# Altium project Sampler.PrjPCB (part 3 of 3)

## Sheet Input_channel.SchDoc: Input chnannel
size 420 x 297 mm; Author: G.K.; CompanyName: WUT; DrawnBy: G.K.; Organization: CERN; Address1: Warsaw Univeristy of Technology; Address2: Nowowiejska 15/19; DocumentNumber: 3; Revision: -; SheetNumber: 3; SheetTotal: 5; EDA_Number: ARTIQ; Projet: Sampler; ModifiedBy: -; CreateDate: XX/XX/XXXX; CheckedDate: -; Title2: DPGA; DivGrp: ISE; Designer: G.K.; ModifiedDate: -; ProjectName: Sampler
Used 8 times, as channels U_Input_channel, U_Input_channel, U_Input_channel, U_Input_channel, U_Input_channel, U_Input_channel, U_Input_channel, U_Input_channel. Parts and nets are listed once, with the designators drawn on the sheet.
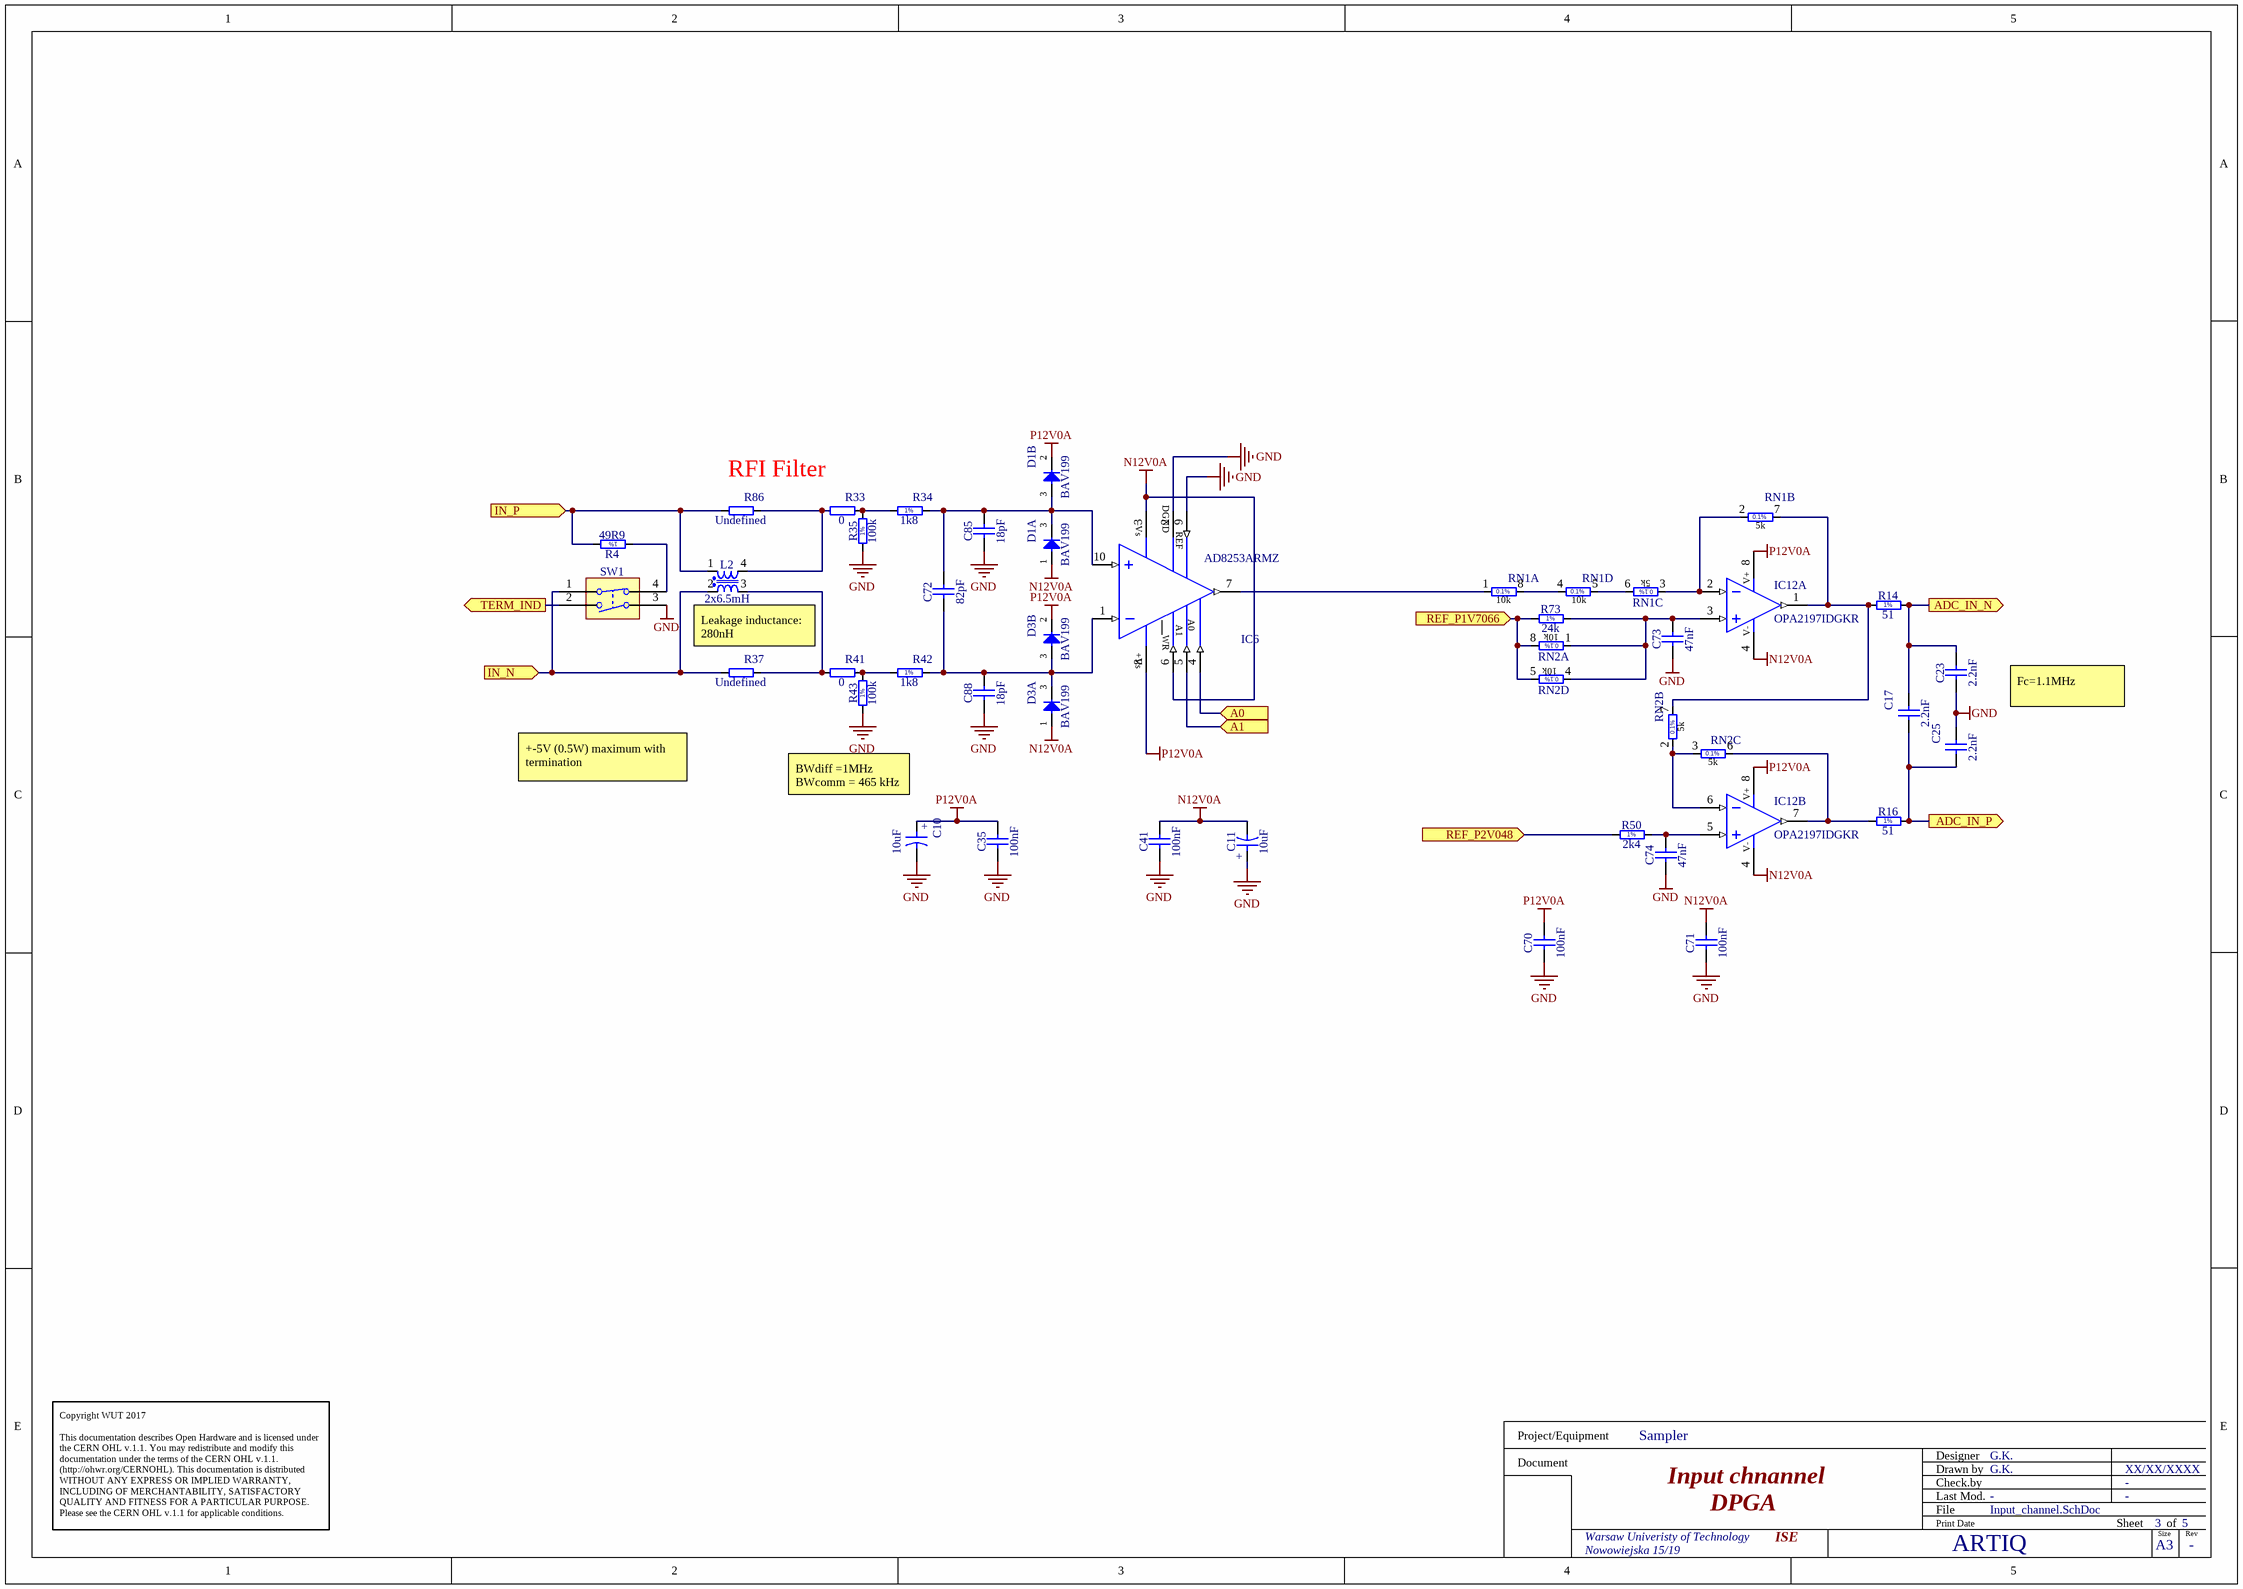
[diagram p5: Input_channel.SchDoc]

### Parts
C10  10uF  [CAPMP3216X180N]
C11  10uF  [CAPMP3216X180N]
C17  2.2nF  [CAPC2013X100N]
C23  2.2nF  [CAPC2013X100N]
C25  2.2nF  [CAPC2013X100N]
C35  100nF  [CAPC1005X55N]
C41  100nF  [CAPC1005X55N]
C70  100nF  [CAPC1005X55N]
C71  100nF  [CAPC1005X55N]
C72  82pF  [CAPC2012X90N]
C73  47nF  [CAPC2012X135N]
C74  47nF  [CAPC2012X135N]
C85  18pF  [CAPC1608X87N]
C88  18pF  [CAPC1608X87N]
D1  BAV199  [SOT95P240X110-3N]  (parts A,B of 2)
D3  BAV199  [SOT95P240X110-3N]  (parts A,B of 2)
IC6  AD8253ARMZ  [SOP50P490X110-10N]
IC12  OPA2197IDGKR  [SOP65P490X110-8N]  (parts A,B of 2)
L2  2x6.5mH  [IND_WURTH_WE-SL2]
R4  49R9  [RESC6331X70N]
R14  51  [RESC1005X40N]
R16  51  [RESC1005X40N]
R33  0  [RESC1608X55N]
R34  1k8  [RESC1608X55N]
R35  100k  [RESC1608X55N]
R37  Undefined  [RESC1608X55N]
R41  0  [RESC1608X55N]
R42  1k8  [RESC1608X55N]
R43  100k  [RESC1608X55N]
R50  2k4  [RESC1005X40N]
R73  24k  [RESC1608X55N]
R86  Undefined  [RESC1608X55N]
RN1  10k 5K 5K 10K  [SOIC127P600X175-8N]  (value not drawn)  (parts A,B,C,D of 4)
RN2  10k 5K 5K 10K  [SOIC127P600X175-8N]  (value not drawn)  (parts A,B,C,D of 4)
SW1  Switch  [SW_CTS_204-121ST]  (value not drawn)

### Ports
A0 (in), A1 (in), ADC_IN_N (out), ADC_IN_P (out), IN_N (in), IN_P (in), REF_P1V7066 (in), REF_P2V048 (in), TERM_IND (out)

### Nets
GND: C10.2 C11.1 C23.1 C25.2 C35.1 C41.1 C70.1 C71.1 C73.1 C74.1 C85.1 C88.1 IC6.2(DGND) IC6.9(REF) R35.1 R43.1 SW1.3
N12V0A: C11.2 C41.2 C71.2 D1.1(A) D3.1(A) IC6.3(-VS) IC6.6(~{WR}) IC12.4(V-)
P12V0A: C10.1 C35.2 C70.2 D1.2(C) D3.2(C) IC6.8(+VS) IC12.8(V+)
A0: IC6.4(A0) ; port A0
A1: IC6.5(A1) ; port A1
ADC_IN_N: C17.2 C23.2 R14.2 ; port ADC_IN_N
ADC_IN_P: C17.1 C25.1 R16.2 ; port ADC_IN_P
IN_N: L2.2 R37.1 SW1.1 ; port IN_N
IN_P: L2.1 R4.2 R86.1 ; port IN_P
REF_P1V7066: R73.1 RN2.5 RN2.8 ; port REF_P1V7066
REF_P2V048: R50.1 ; port REF_P2V048
TERM_IND: SW1.2 ; port TERM_IND
NetC72_1: C72.1 C88.2 D3.3(COMAC) IC6.1(-IN) R42.2
NetC72_2: C72.2 C85.2 D1.3(COMAC) IC6.10(+IN) R34.2
NetC73_2: C73.2 IC12.3(IN+) R73.2 RN2.1 RN2.4
NetC74_2: C74.2 IC12.5(IN+) R50.2
NetIC6_7: IC6.7(OUT) RN1.1
NetIC12_1: IC12.1(OUT) R14.1 RN1.7 RN2.7
NetIC12_2: IC12.2(IN-) RN1.2 RN1.3
NetIC12_6: IC12.6(IN-) RN2.2 RN2.3
NetIC12_7: IC12.7(OUT) R16.1 RN2.6
NetL2_3: L2.3 R37.2 R41.1
NetL2_4: L2.4 R33.1 R86.2
NetR4_1: R4.1 SW1.4
NetR33_2: R33.2 R34.1 R35.2
NetR41_2: R41.2 R42.1 R43.2
NetRN1_4: RN1.4 RN1.8
NetRN1_5: RN1.5 RN1.6

### Channels
U_Input_channel: designators end in A; ports A0=CH7_A0 A1=CH7_A1 ADC_IN_N=IN_7_N ADC_IN_P=IN_7_P IN_N=ADC_IN_N7 IN_P=ADC_IN_P7 REF_P1V7066=REF_P1V7066 REF_P2V048=REF_P2V048 TERM_IND=TERM_STAT7
U_Input_channel: designators end in B; ports A0=CH6_A0 A1=CH6_A1 ADC_IN_N=IN_6_N ADC_IN_P=IN_6_P IN_N=ADC_IN_N6 IN_P=ADC_IN_P6 REF_P1V7066=REF_P1V7066 REF_P2V048=REF_P2V048 TERM_IND=TERM_STAT6
U_Input_channel: designators end in C; ports A0=CH5_A0 A1=CH5_A1 ADC_IN_N=IN_5_N ADC_IN_P=IN_5_P IN_N=ADC_IN_N5 IN_P=ADC_IN_P5 REF_P1V7066=REF_P1V7066 REF_P2V048=REF_P2V048 TERM_IND=TERM_STAT5
U_Input_channel: designators end in D; ports A0=CH4_A0 A1=CH4_A1 ADC_IN_N=IN_4_N ADC_IN_P=IN_4_P IN_N=ADC_IN_N4 IN_P=ADC_IN_P4 REF_P1V7066=REF_P1V7066 REF_P2V048=REF_P2V048 TERM_IND=TERM_STAT4
U_Input_channel: designators end in E; ports A0=CH3_A0 A1=CH3_A1 ADC_IN_N=IN_3_N ADC_IN_P=IN_3_P IN_N=ADC_IN_N3 IN_P=ADC_IN_P3 REF_P1V7066=REF_P1V7066 REF_P2V048=REF_P2V048 TERM_IND=TERM_STAT3
U_Input_channel: designators end in F; ports A0=CH2_A0 A1=CH2_A1 ADC_IN_N=IN_2_N ADC_IN_P=IN_2_P IN_N=ADC_IN_N2 IN_P=ADC_IN_P2 REF_P1V7066=REF_P1V7066 REF_P2V048=REF_P2V048 TERM_IND=TERM_STAT2
U_Input_channel: designators end in G; ports A0=CH1_A0 A1=CH1_A1 ADC_IN_N=IN_1_N ADC_IN_P=IN_1_P IN_N=ADC_IN_N1 IN_P=ADC_IN_P1 REF_P1V7066=REF_P1V7066 REF_P2V048=REF_P2V048 TERM_IND=TERM_STAT1
U_Input_channel: designators end in H; ports A0=CH0_A0 A1=CH0_A1 ADC_IN_N=IN_0_N ADC_IN_P=IN_0_P IN_N=ADC_IN_N0 IN_P=ADC_IN_P0 REF_P1V7066=REF_P1V7066 REF_P2V048=REF_P2V048 TERM_IND=TERM_STAT0

### Notes on the sheet
- RFI Filter
- (near L2) Leakage inductance: 280nH
- Fc=1.1MHz
- +-5V (0.5W) maximum with termination
- BWdiff =1MHz
  BWcomm = 465 kHz
- Copyright WUT 2017
  This documentation describes Open Hardware and is licensed under the CERN OHL v.1.1. You may redistribute and modify this documentation under the terms of the CERN OHL v.1.1. (http://ohwr.org/CERNOHL). This documentation is distributed WITHOUT ANY EXPRESS OR IMPLIED WARRANTY, INCLUDING OF MERCHANTABILITY, SATISFACTORY QUALITY AND FITNESS FOR A PARTICULAR PURPOSE. Please see the CERN OHL v.1.1 for applicable conditions.
- Project/Equipment
- Document
- Designer
- Drawn by
- Check.by
- File
- Last Mod.
- Print Date
- Sheet
- Size
- A3
- of
- Rev
- (in symbol AD8253ARMZ) -Vs; WR; +Vs
- (in symbol CTE3216-18_10UF_16V_20%_AVX_TCJ) +
- (in symbol R0402_2K4_1%_0.0625W_100PPM) 1%
- (in symbol R0402_51R_1%_0.0625W_100PPM) 1%
- (in symbol R0603_1K8_1%_0.1W_100PPM) 1%
- (in symbol R0603_24K_1%_0.1W_100PPM) 1%
- (in symbol R0603_100K_1%_0.1W_100PPM) 1%
- (in symbol R2512_49R9_1%_1W_100PPM_VISHAY_CRCW) 1%
- (in symbol RN_10K_5K_VISHAY_AORN2-1AT3, part A) 10k
- (in symbol RN_10K_5K_VISHAY_AORN2-1AT3, part B) 5k
- (in symbol RN_10K_5K_VISHAY_AORN2-1AT3, part C) 5k
- (in symbol RN_10K_5K_VISHAY_AORN2-1AT3, part D) 10k

### Library data of the parts
C10 C11 = CTE3216-18_10UF_16V_20%_AVX_TCJ: Polarised capacitor; Part Description: ESR 0R200 Tantalum Solid Electrolytic Chip Capacitor with Conductive Polymer Electrode; Manufacturer: AVX; Manufacturer Part Number: TCJA106M016R0200; Voltage: 16V; Tolerance: ±20%; Part Number: CTE3216-18_10UF_16V_20%_AVX_TCJ; Component Kind: Standard; Component Type: Standard; Pin Count: 2; Value: 10uF; Status: Preferred; Case: A; Mounted: Yes; Socket: No; SMD: Yes; Sense: No; ComponentHeight: 1.8mm; HelpURL: \\cern.ch\dfs\Applications\Altium\Datasheets\CTE_AVX_TCJ.pdf; Author: CERN DEM JLC; CreateDate: 29.03.2012; LatestRevisionDate: 29.03.2012
C17 C23 C25 = CC0805_2.2NF_25V_1%_C0G: Non-polarised capacitor; Part Description: SMD Multilayer Chip Ceramic Capacitor; Manufacturer: GENERIC; Manufacturer1 Part Number: C0805C222F3GACTU; Voltage: 25V; TC: C0G/NP0; Tolerance: ±1%; Part Number: CC0805_2.2NF_25V_1%_C0G; Component Kind: Standard; Component Type: Standard; Pin Count: 2; Value: 2.2nF; Status: None; Manufacturer Part Number: CC0805_2.2NF_25V_1%_C0G; Case: 0805; Mounted: Yes; Socket: No; SMD: Yes; Sense: No; Manufacturer1 Example: KEMET; Manufacturer1 ComponentHeight: 0.88mm; HelpURL: \\cern.ch\dfs\Applications\Altium\Datasheets\CC0805_C0G_KEMET_(Commercial Grade).pdf; Author: CERN DEM JLC; CreateDate: 11.03.2015; LatestRevisionDate: 11.03.2015
C35 C41 C70 C71 = CC0402_100NF_16V_10%_X7R: Non-polarised capacitor; Part Description: SMD Multilayer Chip Ceramic Capacitor; Manufacturer: GENERIC; Manufacturer1 Part Number: GRM155R71C104KA88D; Voltage: 16V; TC: X7R; Tolerance: ±10%; Part Number: CC0402_100NF_16V_10%_X7R; Component Kind: Standard; Component Type: Standard; Pin Count: 2; Value: 100nF; Status: Not Recommended; Manufacturer Part Number: CC0402_100NF_16V_10%_X7R; Case: 0402; Mounted: Yes; Socket: No; SMD: Yes; Sense: No; Manufacturer1 Example: MURATA; Manufacturer1 ComponentHeight: 0.55mm; HelpURL: \\cern.ch\dfs\Applications\Altium\Datasheets\CC0402_X7R_MURATA_GRM.pdf; Author: CERN DEM JLC; CreateDate: 2013-12-05; LatestRevisionDate: 2007-12-03
C72 = CC0805_82PF_100V_1%_NP0_AVX_08051A820FAT2A: Non-polarised capacitor; Part Description: SMD Multilayer Chip Ceramic Capacitor; Manufacturer: AVX; Voltage: 100V; TC: NP0; Tolerance: ±1%; Part Number: CC0805_82PF_100V_1%_NP0_AVX_08051A820FAT2A; Component Kind: Standard; Component Type: Standard; Pin Count: 2; Value: 82pF; Status: Not Recommended; Manufacturer Part Number: 08051A820FAT2A; Case: 0805; Mounted: Yes; Socket: No; SMD: Yes; Sense: No; ComponentHeight: 0.9mm; HelpURL: \\cern.ch\dfs\Applications\Altium\Datasheets\CC0805_C0G_AVX.pdf; Author: CERN DEM WB; CreateDate: 26.07.2016; LatestRevisionDate: 26.07.2016
C73 C74 = CC0805_47NF_25V_5%_C0G: Non-polarised capacitor; Part Description: SMD Multilayer Chip Ceramic Capacitor; Manufacturer: GENERIC; Manufacturer1 Part Number: C0805C473J3GACTU; Voltage: 25V; TC: C0G/NP0; Tolerance: ±5%; Part Number: CC0805_47NF_25V_5%_C0G; Component Kind: Standard; Component Type: Standard; Pin Count: 2; Value: 47nF; Status: None; Manufacturer Part Number: CC0805_47NF_25V_5%_C0G; Case: 0805; Mounted: Yes; Socket: No; SMD: Yes; Sense: No; Manufacturer1 Example: KEMET; Manufacturer1 ComponentHeight: 1.4mm; HelpURL: \\cern.ch\dfs\Applications\Altium\Datasheets\CC0805_C0G_KEMET_(Commercial Grade).pdf; Author: CERN DEM JLC; CreateDate: 18.01.2011; LatestRevisionDate: 18.01.2011
C85 C88 = CC0603_18PF_50V_5%_NP0: Non-polarised capacitor; Part Description: SMD Multilayer Chip Ceramic Capacitor; Manufacturer: GENERIC; Manufacturer1 Part Number: 223886715189; Voltage: 50V; TC: C0G/NP0; Tolerance: ±5%; Part Number: CC0603_18PF_50V_5%_NP0; Component Kind: Standard; Component Type: Standard; Pin Count: 2; Value: 18pF; Status: Preferred; Manufacturer Part Number: CC0603_18PF_50V_5%_NP0; Case: 0603; Mounted: Yes; Socket: No; SMD: Yes; Sense: No; Manufacturer1 Example: PHYCOMP; Manufacturer1 ComponentHeight: 0.87mm; HelpURL: \\cern.ch\dfs\Applications\Altium\Datasheets\CC0603_NP0_PHYCOMP.pdf; Author: CERN DEM JLC; CreateDate: 03.12.2007; LatestRevisionDate: 03.12.2007
D1 D3 = BAV199: Serial Diode; Part Description: Low-Leakage Double Diode; Manufacturer: NXP SEMICONDUCTORS; Voltage: 75V; Power: 250mW; PressFit: No; Bonding: No; Part Number: BAV199; Component Kind: Standard; Component Type: Standard; Device: BAV199; PackageDescription: SOT23 3-Leads, Pitch 0.95mm - Body 1.4x3mm, IPC Medium Density; Manufacturer Part Number: BAV199; Pin Count: 3; Case: SOT23-3; Mounted: Yes; Socket: No; SMD: Yes; Sense: No; ComponentHeight: 1.1mm; HelpURL: \\cern.ch\dfs\Applications\Altium\Datasheets\BAV199.pdf; Author: CERN DEM JMW; CreateDate: 2008-11-21; LatestRevisionDate: 2008-11-21
IC6 = AD8253ARMZ: 10MHz, 20V/us, G= 1, 10, 100, 1000 iCMOS Programmable Gain Instrumentation Amplifier; Manufacturer: ANALOG DEVICES; PressFit: No; Bonding: No; Part Number: AD8253ARMZ; Component Kind: Standard; Component Type: Standard; Device: AD8253ARMZ; PackageDescription: MSOP, 10-Leads, Body 3.1x3.1mm (max), Pitch 0.50mm, IPC Medium Density; Part Description: 10MHz, 20V/us, G= 1, 10, 100, 1000 iCMOS Programmable Gain Instrumentation Amplifier; Manufacturer Part Number: AD8253ARMZ; Pin Count: 8; Case: MSOP10; Mounted: Yes; Socket: No; SMD: Yes; Sense: No; ComponentHeight: 1.1mm; Author: CERN DEM JLC; HelpURL: \\cern.ch\dfs\Applications\Altium\Datasheets\AD8253ARMZ.pdf; CreateDate: 2013-10-02; LatestRevisionDate: 2013-10-02
IC12 = OA_OPA2197IDGKR: 36-V, Precision, Rail-to-Rail Input Output, Low Offset Voltage Op Amp 8-VSSOP; Part Description: High-Precision, Low-Noise, Rail-to-Rail Output,10-MHz Op Amp; Manufacturer: TEXAS INSTRUMENTS; PressFit: No; Bonding: No; Part Number: OPA2197IDGKR; Component Kind: Standard; Component Type: Standard; Device: OPA2197IDGKR; PackageDescription: SOP, 0.65mm pitch; 8 pin, 3.00mm W X 3.00mm L X 1.10mm H body, IPC Medium Density; Manufacturer Part Number: OPA2197IDGKR; Pin Count: 8; Case: MSOP8; Mounted: Yes; Socket: No; SMD: Yes; Sense: No; ComponentHeight: 1.1mm; Author: GK; HelpURL: \\cern.ch\dfs\Applications\Altium\Datasheets\OPA2140AIDGK.pdf; CreateDate: 20.04.2017; LatestRevisionDate: 20.04.2017
L2 = IND_6.5MH_50%_WURTH_WE-SL2-744229: Inductor Common Mode; Part Description: Common Mode SMD Line Filter (WE-SL2 Serie); Manufacturer: WURTH ELEKTRONIK; Manufacturer Part Number: 744229; Power: 400mA; Resistance: 0.95R; Tolerance: ±50%; Part Number: IND_6.5MH_50%_WURTH_WE-SL2-744229; Component Kind: Standard; Component Type: Standard; Pin Count: 4; Value: 2x6.5mH; Status: None; Mounted: Yes; Socket: No; SMD: Yes; Sense: No; ComponentHeight: 5.3mm; HelpURL: \\cern.ch\dfs\Applications\Altium\Datasheets\IND_WURTH_WE-SL2_744229.pdf; Author: CERN DEM JLC; CreateDate: 01.10.2012; LatestRevisionDate: 15.10.2012
R4 = R2512_49R9_1%_1W_100PPM_VISHAY_CRCW: Resistor - 1%; Part Description: Thick Film Chip Resistor; Manufacturer: VISHAY DRALORIC; Manufacturer Part Number: CRCW251249R9FKEG; Power: 1W; TC: ±100ppm/°C; PressFit: No; Part Number: R2512_49R9_1%_1W_100PPM_VISHAY_CRCW; Component Kind: Standard; Component Type: Standard; Pin Count: 2; Value: 49R9; Status: None; Tolerance: ±1%; Case: 2512; Mounted: Yes; Sense: No; Socket: No; SMD: Yes; ComponentHeight: 0.7mm; HelpURL: \\cern.ch\dfs\Applications\Altium\Datasheets\R2512_VISHAY_CRCW2512.pdf; Author: CERN DEM JLC; CreateDate: 22.05.2012; LatestRevisionDate: 22.05.2012
R14 R16 = R0402_51R_1%_0.0625W_100PPM: Resistor - 1%; Part Description: General Purpose Thick Film Chip Resistor; Manufacturer: GENERIC; Manufacturer1 Part Number: 232270675109L; TC: ±100ppm/°C; PressFit: No; Part Number: R0402_51R_1%_0.0625W_100PPM; Component Kind: Standard; Component Type: Standard; Pin Count: 2; Value: 51; Status: Not Recommended; Power: 0.0625W; Tolerance: ±1%; Manufacturer Part Number: R0402_51R_1%_0.0625W_100PPM; Case: 0402; Mounted: Yes; Sense: No; Socket: No; SMD: Yes; Manufacturer1 Example: YAGEO PHYCOMP; Manufacturer1 ComponentHeight: 0.4mm; HelpURL: \\cern.ch\dfs\Applications\Altium\Datasheets\R0402_Phycomp_RC0402.pdf; Author: CERN DEM JLC; CreateDate: 03.12.2007; LatestRevisionDate: 17.10.2012
R33 R41 = R0603_0R_JUMPER: Resistor; Part Description: 1A (0.05R Max DC Resistance) Zero Ohm Jumper; Manufacturer: GENERIC; Manufacturer1 Part Number: NRC06Z0; Part Number: R0603_0R_JUMPER; Component Kind: Standard; Component Type: Standard; Pin Count: 2; Value: 0; Status: Preferred; Manufacturer Part Number: R0603_0R_JUMPER; Case: 0603; Mounted: Yes; Sense: No; Socket: No; SMD: Yes; Manufacturer1 Example: NIC COMPONENT; Manufacturer1 ComponentHeight: 0.55mm; HelpURL: \\cern.ch\dfs\Applications\Altium\Datasheets\R0603_NIC_NRC.pdf; Author: CERN DEM JLC; CreateDate: 03.12.2007; LatestRevisionDate: 13.03.2008
R34 R42 = R0603_1K8_1%_0.1W_100PPM: Resistor - 1%; Part Description: General Purpose Thick Film Chip Resistor; Manufacturer: GENERIC; Manufacturer1 Part Number: NRC06F1801TRF; Power: 0.1W; TC: ±100ppm/°C; Part Number: R0603_1K8_1%_0.1W_100PPM; Component Kind: Standard; Component Type: Standard; Pin Count: 2; Value: 1k8; Status: Preferred; Tolerance: ±1%; Manufacturer Part Number: R0603_1K8_1%_0.1W_100PPM; Case: 0603; Mounted: Yes; Sense: No; Socket: No; SMD: Yes; Manufacturer1 Example: NIC COMPONENT; Manufacturer1 ComponentHeight: 0.55mm; HelpURL: \\cern.ch\dfs\Applications\Altium\Datasheets\R0603_NIC_NRC.pdf; Author: CERN DEM JLC; CreateDate: 03.12.2007; LatestRevisionDate: 13.03.2008
R35 R43 = R0603_100K_1%_0.1W_100PPM: Resistor - 1%; Part Description: General Purpose Thick Film Chip Resistor; Manufacturer: GENERIC; Manufacturer1 Part Number: NRC06F1003TRF; Power: 0.1W; TC: ±100ppm/°C; Part Number: R0603_100K_1%_0.1W_100PPM; Component Kind: Standard; Component Type: Standard; Pin Count: 2; Value: 100k; Status: Preferred; Tolerance: ±1%; Manufacturer Part Number: R0603_100K_1%_0.1W_100PPM; Case: 0603; Mounted: Yes; Sense: No; Socket: No; SMD: Yes; Manufacturer1 Example: NIC COMPONENT; Manufacturer1 ComponentHeight: 0.55mm; HelpURL: \\cern.ch\dfs\Applications\Altium\Datasheets\R0603_NIC_NRC.pdf; Author: CERN DEM JLC; CreateDate: 03.12.2007; LatestRevisionDate: 13.03.2008
R37 R86 = R0603_NO-VALUE: Resistor; Part Description: Reserved Footprint For a 0603 (1608) Chip Resistor; Mounted: No; Part Number: R0603_NO-VALUE; Component Kind: Standard; Component Type: Standard; Pin Count: 2; Value: Undefined; Status: None; Manufacturer: Undefined; Manufacturer Part Number: R0603_NO-VALUE; Case: 0603; Sense: No; Socket: No; SMD: Yes; Manufacturer1 Example: Undefined; Manufacturer1 Part Number: Undefined; Manufacturer1 ComponentHeight: Undefined; HelpURL: Undefined; Author: CERN DEM JLC; CreateDate: 03.12.2007; LatestRevisionDate: 13.03.2008
R50 = R0402_2K4_1%_0.0625W_100PPM: Resistor - 1%; Part Description: General Purpose Thick Film Chip Resistor; Manufacturer: GENERIC; Manufacturer1 Part Number: 232270672402L; TC: ±100ppm/°C; PressFit: No; Part Number: R0402_2K4_1%_0.0625W_100PPM; Component Kind: Standard; Component Type: Standard; Pin Count: 2; Value: 2k4; Status: Not Recommended; Power: 0.0625W; Tolerance: ±1%; Manufacturer Part Number: R0402_2K4_1%_0.0625W_100PPM; Case: 0402; Mounted: Yes; Sense: No; Socket: No; SMD: Yes; Manufacturer1 Example: YAGEO PHYCOMP; Manufacturer1 ComponentHeight: 0.4mm; HelpURL: \\cern.ch\dfs\Applications\Altium\Datasheets\R0402_Phycomp_RC0402.pdf; Author: CERN DEM JLC; CreateDate: 03.12.2007; LatestRevisionDate: 17.10.2012
R73 = R0603_24K_1%_0.1W_100PPM: Resistor - 1%; Part Description: General Purpose Thick Film Chip Resistor; Manufacturer: GENERIC; Manufacturer1 Part Number: NRC06F2402TRF; Power: 0.1W; TC: ±100ppm/°C; PressFit: No; Part Number: R0603_24K_1%_0.1W_100PPM; Component Kind: Standard; Component Type: Standard; Pin Count: 2; Value: 24k; Status: Preferred; Tolerance: ±1%; Manufacturer Part Number: R0603_24K_1%_0.1W_100PPM; Case: 0603; Mounted: Yes; Sense: No; Socket: No; SMD: Yes; Manufacturer1 Example: NIC COMPONENT; Manufacturer1 ComponentHeight: 0.55mm; HelpURL: \\cern.ch\dfs\Applications\Altium\Datasheets\R0603_NIC_NRC.pdf; Author: CERN DEM JLC; CreateDate: 03.12.2007; LatestRevisionDate: 13.03.2008
RN1 RN2 = RN_10K_5K_VISHAY_AORN2-1AT3: DIL8 Resistor Network 4 Resistors 10k-5k-5k-10k 0.1%; Part Description: Dual-In-Line Thin Film Precision Automotive Resistors Network, (4 Isolated) - AORN Series; Manufacturer: VISHAY DALE; Power: 4x0.1W; TC: ±25ppm/°C; PressFit: No; Part Number: RN_10K_5K_VISHAY_AORN2-1AT3; Component Kind: Standard; Component Type: Standard; Pin Count: 8; Value: 10k 5K 5K 10K; Sense: No; Tolerance: 0.1%; Manufacturer Part Number: AORN2-1AT3; Case: SOIC8; Mounted: Yes; Socket: No; SMD: Yes; ComponentHeight: 1.73mm; HelpURL: \\cern.ch\dfs\Applications\Altium\Datasheets\RN_VISHAY_AORN.pdf; Author: CERN DEM JLC; CreateDate: 20.02.2017; LatestRevisionDate: 20.02.2017
SW1 = SW_CTS_204-121ST: 2x SPST DIP Switch 1NO + 1NF; Part Description: Coupled SPST DIP Switch, 1NO + 1NF, CTS 204 Series; Manufacturer: CTS; PressFit: No; Part Number: SW_CTS_204-121ST; Component Kind: Standard; Component Type: Standard; Pin Count: 4; PackageDescription: Body 7.26 x 9.78mm, 2x SPST DIP, 1NO + 1NF Switch, CTS 204 Series; Family: Switch; Mounted: Yes; Socket: No; SMD: Yes; Sense: No; Status: None; Manufacturer Part Number: 204-121ST; ComponentHeight: 10.36mm; HelpURL: \\cern.ch\dfs\Applications\Altium\Datasheets\SW_CTS_204-121ST.pdf; Author: CERN DEM JLC; CreateDate: 28.08.2014; LatestRevisionDate: 28.08.2014

## Nets that join several sheets
GND: Sampler (44 pins), ADC_8CH (41 pins), LVDS_IFCA (33 pins), Supply_Sampler (78 pins), LVDS_IFCB (29 pins), U_Input_channel (17 pins), U_Input_channel (17 pins), U_Input_channel (17 pins), U_Input_channel (17 pins), U_Input_channel (17 pins), U_Input_channel (17 pins), U_Input_channel (17 pins), U_Input_channel (17 pins)
N12V0A: ADC_8CH (C22.2 IC5.4), Supply_Sampler (9 pins), U_Input_channel (8 pins), U_Input_channel (8 pins), U_Input_channel (8 pins), U_Input_channel (8 pins), U_Input_channel (8 pins), U_Input_channel (8 pins), U_Input_channel (8 pins), U_Input_channel (8 pins)
N13V0: Sampler (R6.2), Supply_Sampler (7 pins)
P2V5A: ADC_8CH (7 pins), LVDS_IFCA (C67.2 IC23.1), Supply_Sampler (8 pins)
P3V3: Sampler (23 pins), LVDS_IFCA (16 pins), Supply_Sampler (10 pins), LVDS_IFCB (16 pins)
P3V3_MP1: Sampler (LD5.4), LVDS_IFCB (5 pins)
P5V0A: ADC_8CH (10 pins), Supply_Sampler (6 pins)
P12V0: Sampler (R74.2), LVDS_IFCA (J13.28 J13.29), Supply_Sampler (C48.2 IC15.8 L6.1), LVDS_IFCB (J2.28 J2.29)
P12V0A: ADC_8CH (C20.2 IC5.8), Supply_Sampler (7 pins), U_Input_channel (7 pins), U_Input_channel (7 pins), U_Input_channel (7 pins), U_Input_channel (7 pins), U_Input_channel (7 pins), U_Input_channel (7 pins), U_Input_channel (7 pins), U_Input_channel (7 pins)
P13V0: Sampler (R3.2), Supply_Sampler (9 pins)
REF_P1V7066: ADC_8CH (IC5.7 R72.2 RN4.7), U_Input_channel (R73A.1 RN2A.5 RN2A.8), U_Input_channel (R73B.1 RN2B.5 RN2B.8), U_Input_channel (R73C.1 RN2C.5 RN2C.8), U_Input_channel (R73D.1 RN2D.5 RN2D.8), U_Input_channel (R73E.1 RN2E.5 RN2E.8), U_Input_channel (R73F.1 RN2F.5 RN2F.8), U_Input_channel (R73G.1 RN2G.5 RN2G.8), U_Input_channel (R73H.1 RN2H.5 RN2H.8)
REF_P2V048: ADC_8CH (IC5.1 RN3.6 RN4.3), U_Input_channel (R50A.1), U_Input_channel (R50B.1), U_Input_channel (R50C.1), U_Input_channel (R50D.1), U_Input_channel (R50E.1), U_Input_channel (R50F.1), U_Input_channel (R50G.1), U_Input_channel (R50H.1)
REF_P4V096: ADC_8CH (6 pins), Supply_Sampler (R22.1)
REF_VCC: ADC_8CH (R15.1), Supply_Sampler (8 pins)
ADC_CLKOUT_N: ADC_8CH (IC2.34), LVDS_IFCB (IC25.8 R44.2)
ADC_CLKOUT_P: ADC_8CH (IC2.33), LVDS_IFCB (IC25.1 R44.1)
ADC_IN_N0: Sampler (J1.23 J3.1), U_Input_channel (L2H.2 R37H.1 SW1H.1)
ADC_IN_N1: Sampler (J1.20 J3.3), U_Input_channel (L2G.2 R37G.1 SW1G.1)
ADC_IN_N2: Sampler (J1.17 J4.1), U_Input_channel (L2F.2 R37F.1 SW1F.1)
ADC_IN_N3: Sampler (J1.14 J4.3), U_Input_channel (L2E.2 R37E.1 SW1E.1)
ADC_IN_N4: Sampler (J1.11 J5.1), U_Input_channel (L2D.2 R37D.1 SW1D.1)
ADC_IN_N5: Sampler (J1.8 J5.3), U_Input_channel (L2C.2 R37C.1 SW1C.1)
ADC_IN_N6: Sampler (J1.5 J6.1), U_Input_channel (L2B.2 R37B.1 SW1B.1)
ADC_IN_N7: Sampler (J1.2 J6.3), U_Input_channel (L2A.2 R37A.1 SW1A.1)
ADC_IN_P0: Sampler (J1.22 J3.4), U_Input_channel (L2H.1 R4H.2 R86H.1)
ADC_IN_P1: Sampler (J1.19 J3.2), U_Input_channel (L2G.1 R4G.2 R86G.1)
ADC_IN_P2: Sampler (J1.16 J4.4), U_Input_channel (L2F.1 R4F.2 R86F.1)
ADC_IN_P3: Sampler (J1.13 J4.2), U_Input_channel (L2E.1 R4E.2 R86E.1)
ADC_IN_P4: Sampler (J1.10 J5.4), U_Input_channel (L2D.1 R4D.2 R86D.1)
ADC_IN_P5: Sampler (J1.7 J5.2), U_Input_channel (L2C.1 R4C.2 R86C.1)
ADC_IN_P6: Sampler (J1.4 J6.4), U_Input_channel (L2B.1 R4B.2 R86B.1)
ADC_IN_P7: Sampler (J1.1 J6.2), U_Input_channel (L2A.1 R4A.2 R86A.1)
ADC_SCK_N: ADC_8CH (IC2.42 R9.1), LVDS_IFCA (IC21.5)
ADC_SCK_P: ADC_8CH (IC2.41 R9.2), LVDS_IFCA (IC21.6)
ADC_SDOA_N: ADC_8CH (IC2.28), LVDS_IFCA (IC22.1), LVDS_IFCB (IC27.1 R17.1)
ADC_SDOA_P: ADC_8CH (IC2.27), LVDS_IFCA (IC22.8), LVDS_IFCB (IC27.8 R17.2)
ADC_SDOB_N: ADC_8CH (IC2.30), LVDS_IFCB (IC28.8 R45.2)
ADC_SDOB_P: ADC_8CH (IC2.29), LVDS_IFCB (IC28.1 R45.1)
ADC_SDOC_N: ADC_8CH (IC2.36), LVDS_IFCB (IC29.8 R46.2)
ADC_SDOC_P: ADC_8CH (IC2.35), LVDS_IFCB (IC29.1 R46.1)
ADC_SDOD_N: ADC_8CH (IC2.40), LVDS_IFCB (IC30.8 R47.2)
ADC_SDOD_P: ADC_8CH (IC2.39), LVDS_IFCB (IC30.1 R47.1)
CH0_A0: Sampler (IC10.15), U_Input_channel (IC6H.4)
CH0_A1: Sampler (IC10.1), U_Input_channel (IC6H.5)
CH1_A0: Sampler (IC10.2), U_Input_channel (IC6G.4)
CH1_A1: Sampler (IC10.3), U_Input_channel (IC6G.5)
CH2_A0: Sampler (IC10.4), U_Input_channel (IC6F.4)
CH2_A1: Sampler (IC10.5), U_Input_channel (IC6F.5)
CH3_A0: Sampler (IC10.6), U_Input_channel (IC6E.4)
CH3_A1: Sampler (IC10.7), U_Input_channel (IC6E.5)
CH4_A0: Sampler (IC11.15), U_Input_channel (IC6D.4)
CH4_A1: Sampler (IC11.1), U_Input_channel (IC6D.5)
CH5_A0: Sampler (IC11.2), U_Input_channel (IC6C.4)
CH5_A1: Sampler (IC11.3), U_Input_channel (IC6C.5)
CH6_A0: Sampler (IC11.4), U_Input_channel (IC6B.4)
CH6_A1: Sampler (IC11.5), U_Input_channel (IC6B.5)
CH7_A0: Sampler (IC11.6), U_Input_channel (IC6A.4)
CH7_A1: Sampler (IC11.7), U_Input_channel (IC6A.5)
IN_0_N: ADC_8CH (IC2.47), U_Input_channel (C17H.2 C23H.2 R14H.2)
IN_0_P: ADC_8CH (IC2.48), U_Input_channel (C17H.1 C25H.1 R16H.2)
IN_1_N: ADC_8CH (IC2.50), U_Input_channel (C17G.2 C23G.2 R14G.2)
IN_1_P: ADC_8CH (IC2.51), U_Input_channel (C17G.1 C25G.1 R16G.2)
IN_2_N: ADC_8CH (IC2.1), U_Input_channel (C17F.2 C23F.2 R14F.2)
IN_2_P: ADC_8CH (IC2.2), U_Input_channel (C17F.1 C25F.1 R16F.2)
IN_3_N: ADC_8CH (IC2.4), U_Input_channel (C17E.2 C23E.2 R14E.2)
IN_3_P: ADC_8CH (IC2.5), U_Input_channel (C17E.1 C25E.1 R16E.2)
IN_4_N: ADC_8CH (IC2.10), U_Input_channel (C17D.2 C23D.2 R14D.2)
IN_4_P: ADC_8CH (IC2.11), U_Input_channel (C17D.1 C25D.1 R16D.2)
IN_5_N: ADC_8CH (IC2.13), U_Input_channel (C17C.2 C23C.2 R14C.2)
IN_5_P: ADC_8CH (IC2.14), U_Input_channel (C17C.1 C25C.1 R16C.2)
IN_6_N: ADC_8CH (IC2.16), U_Input_channel (C17B.2 C23B.2 R14B.2)
IN_6_P: ADC_8CH (IC2.17), U_Input_channel (C17B.1 C25B.1 R16B.2)
IN_7_N: ADC_8CH (IC2.19), U_Input_channel (C17A.2 C23A.2 R14A.2)
IN_7_P: ADC_8CH (IC2.20), U_Input_channel (C17A.1 C25A.1 R16A.2)
NetD6_1: ADC_8CH (IC1.1 IC31.1), Supply_Sampler (D6.1 IC26.7 R57.1)
NetIC2_24: ADC_8CH (IC2.24), LVDS_IFCA (IC23.5)
NetIC10_13: Sampler (IC10.13 IC11.13), Supply_Sampler (IC15.7 R51.2)
NetIC24_5: ADC_8CH (T9.1), LVDS_IFCA (IC24.5)
PGIA-CS: Sampler (IC10.12 IC11.12), LVDS_IFCA (IC20.5)
PGIA-MISO: Sampler (IC11.9), LVDS_IFCA (IC19.5)
PGIA-MOSI: Sampler (IC10.14), LVDS_IFCA (IC18.5)
PGIA-SCK: Sampler (IC10.11 IC11.11), LVDS_IFCA (IC17.5)
TERM_STAT0: Sampler (R5.2 T1.1), LVDS_IFCA (IC38.4), U_Input_channel (SW1H.2)
TERM_STAT1: Sampler (R12.2 T2.1), LVDS_IFCA (IC38.5), U_Input_channel (SW1G.2)
TERM_STAT2: Sampler (R13.2 T3.1), LVDS_IFCA (IC38.6), U_Input_channel (SW1F.2)
TERM_STAT3: Sampler (R49.2 T4.1), LVDS_IFCA (IC38.7), U_Input_channel (SW1E.2)
TERM_STAT4: Sampler (R68.2 T5.1), LVDS_IFCA (IC38.9), U_Input_channel (SW1D.2)
TERM_STAT5: Sampler (R69.2 T6.1), LVDS_IFCA (IC38.10), U_Input_channel (SW1C.2)
TERM_STAT6: Sampler (R70.2 T7.1), LVDS_IFCA (IC38.11), U_Input_channel (SW1B.2)
TERM_STAT7: Sampler (R71.2 T8.1), LVDS_IFCA (IC38.12), U_Input_channel (SW1A.2)

## Assembly variants
STD: not fitted C17A C17B C17C C17D C17E C17F C17G C17H C47 C80 C83 C116 CLIP6 CLIP7 CLIP11 CLIP12 CLIP13 CLIP14 CLIP15 CLIP16 CLIP17 CLIP18 CLIP19 CLIP20 CLIP21 CLIP22 CLIP23 CLIP24 CLIP25 CLIP26 IC1 IC4 IC7 IC34 R7
4HP: not fitted J3 J4 J5 J6